# Altium schematic sheet Schematic_EnivoSys.SchDoc
size A; PageSetup: Record=PageOptions|CenterHorizontal=True|CenterVertical=True|PrintScale=1.12|XCorrection=1.00|YCorrection=1.00|PrintKind=1|BorderSize=5000000|LeftOffset=0|BottomOffset=0|Orientation=2|PaperLength=1000|PaperWidth=1000|Scale=100|PaperSource=7|PrintQuality=600|MediaType=1|DitherType=10|PaperKind=Letter|PrintScaleMode=1
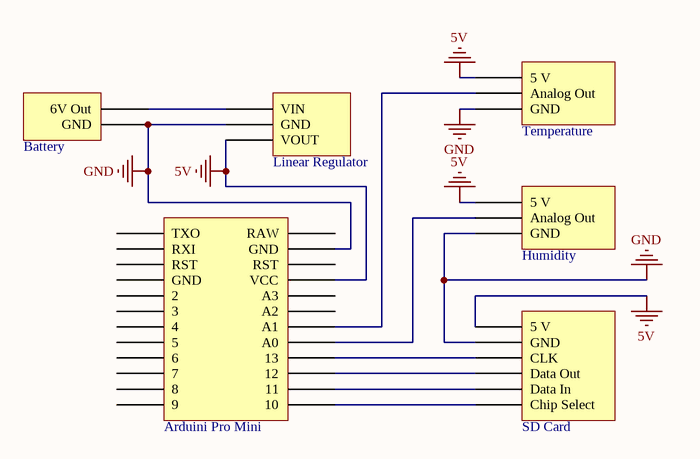
[diagram p0: Schematic_EnivoSys.SchDoc]

## Parts
(Parts that share a designator on the sheet are numbered #1, #2 ... from top to bottom, then left to right.)
*#1  Battery
*#2  SD Card
?#1  Linear Regulator
?#2  Temperature
?#3  Humidity
?#4  Arduini Pro Mini

## Nets
5V: *#2.1(5_V) ?#1.3(VOUT) ?#2.1(5_V) ?#3.1(5_V) ?#4.92(GND)
GND: *#1.RXI(GND) *#2.2(GND) ?#1.2(GND) ?#2.3(GND) ?#3.3(GND) ?#4.90(GND)
Net*#1_RXI: *#1.RXI(6V_Out) ?#1.1(VIN)
Net*#2_RXI: *#2.RXI(CLK) ?#4.97(6)
Net*#2_RXI: *#2.RXI(Data_Out) ?#4.98(7)  [a separate net that carries the same name]
Net*#2_RXI: *#2.RXI(Data_In) ?#4.99(8)  [a separate net that carries the same name]
Net*#2_RXI: *#2.RXI(Chip_Select) ?#4.100(9)  [a separate net that carries the same name]
Net?#2_2: ?#2.2(Analog_Out) ?#4.95(4)
Net?#3_2: ?#3.2(Analog_Out) ?#4.96(5)

Not connected (* = marked no-connect by the designer): ?#4 1(TXO) 89(RAW) 91(RST) 93(2) 94(3) RXI

## Notes on the sheet
- Title
- Size:
- Date:
- A
- Number:
- Time:
- Revision:
- Sheet
- of
- File:

## Library data of the parts
*#1 *#2 ?#1-?#3 = Component_1